# Altium schematic sheet DC309A_CoverPage_Compact.SchDoc: CoverPage
size 558 x 431 mm; DrawnBy: KAVIKANNAN; DocumentNumber: 1; SheetNumber: 1; SheetTotal: 11; PageSetup: Record=PageOptions|CenterHorizontal=True|CenterVertical=True|PrintScale=1.00|XCorrection=1.00|YCorrection=1.00|PrintKind=0|BorderSize=5000000|LeftOffset=0|BottomOffset=0|Orientation=2|PaperLength=1000|PaperWidth=1000|Scale=100|PaperSource=15|PrintQuality=600|MediaType=1|DitherType=10|PaperKind=Letter|PrintScaleMode=1
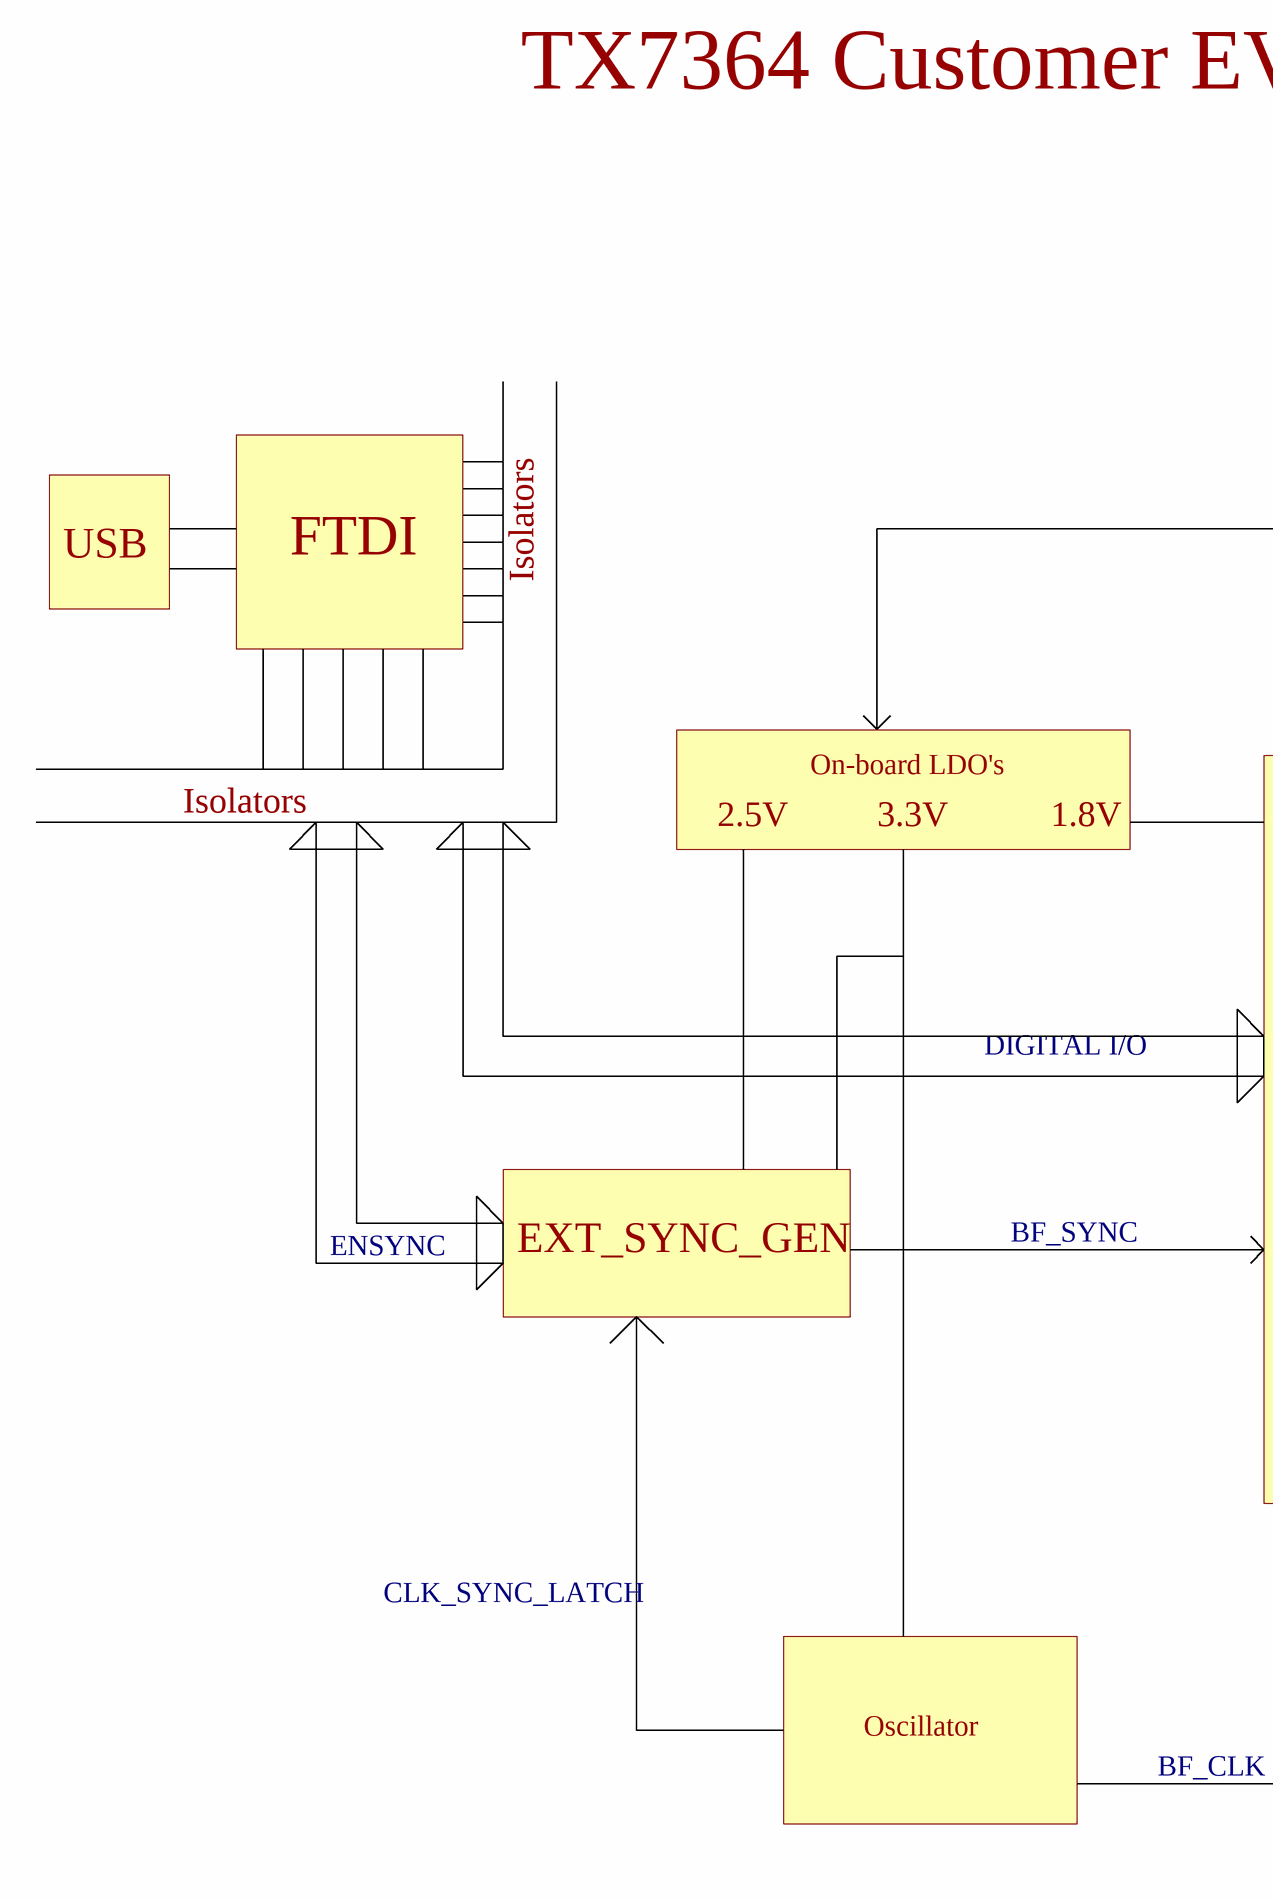
[diagram p0: DC309A_CoverPage_Compact.SchDoc, left]
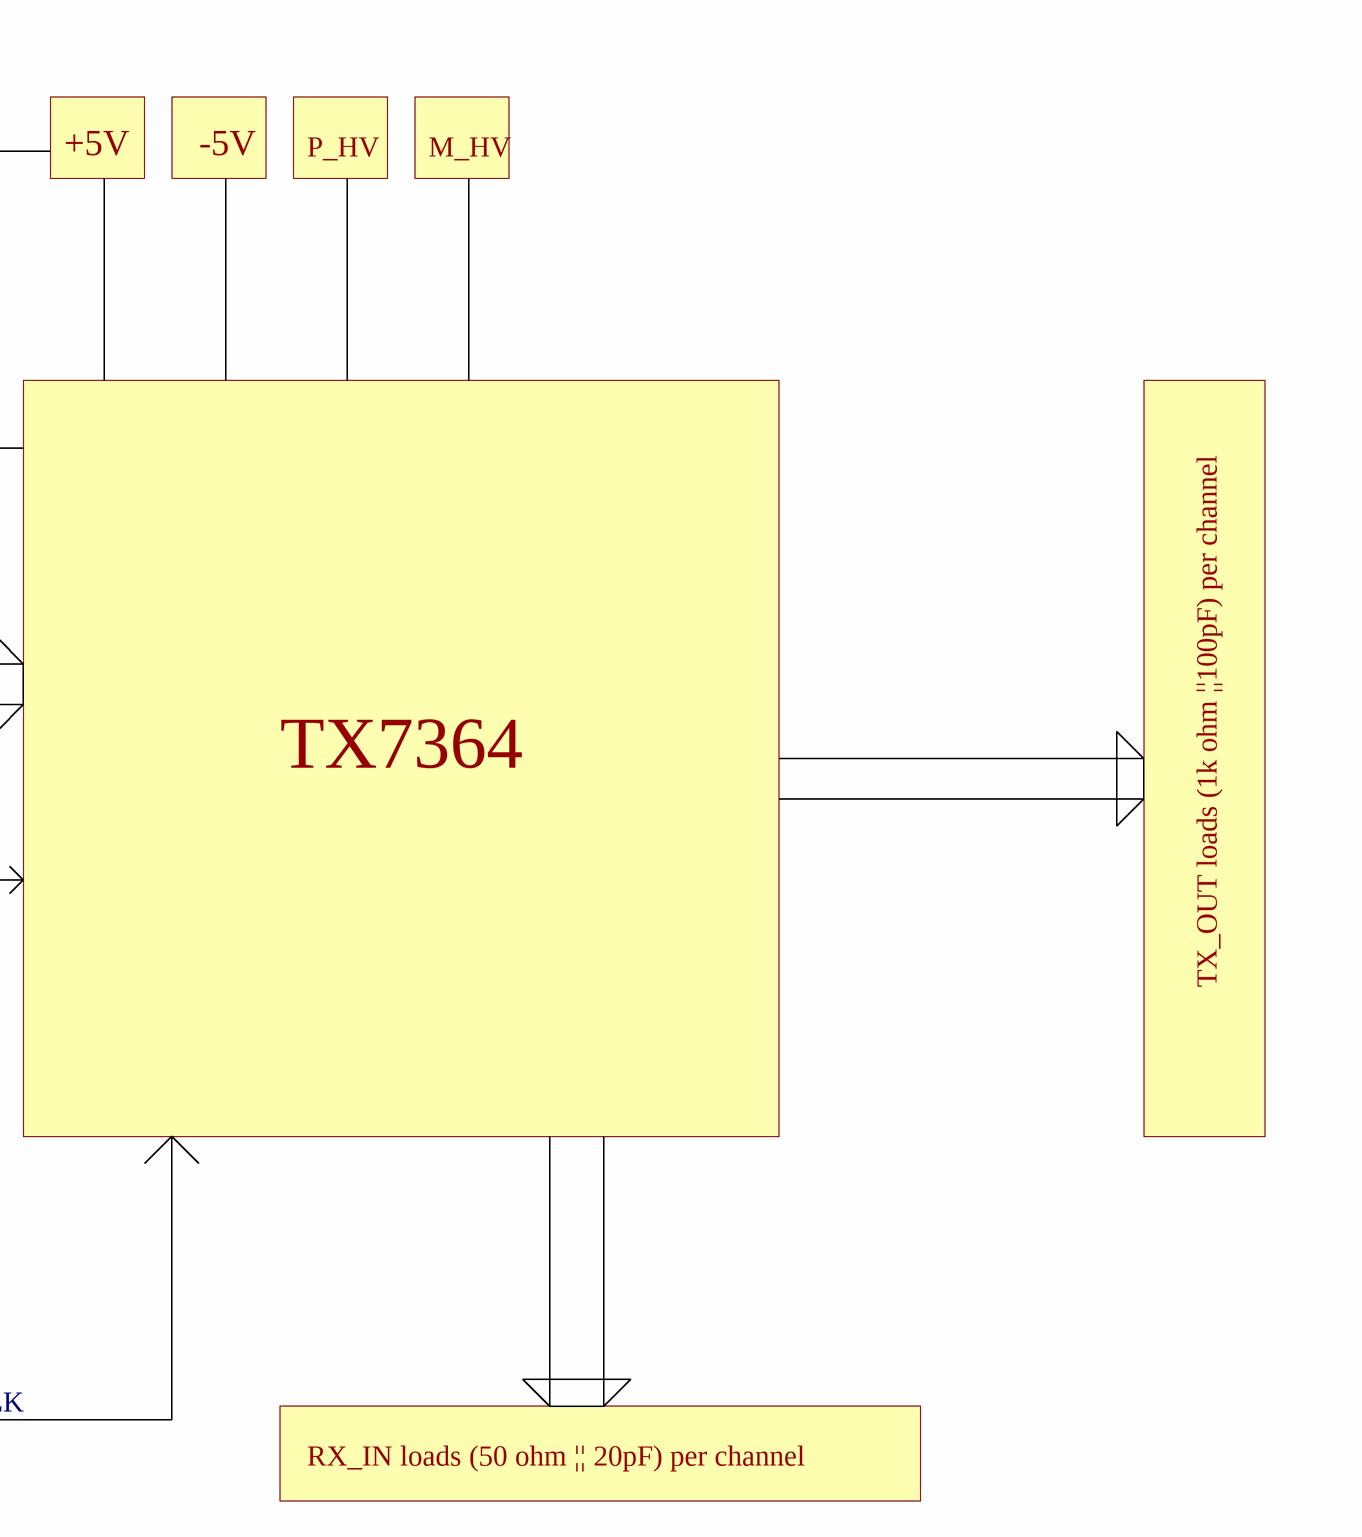
[diagram p1: DC309A_CoverPage_Compact.SchDoc, right]

## Notes on the sheet
- TX7364 Customer EVM : Functional block diagram
- USB
- FTDI
- Isolators
- +5V
- -5V
- P_HV
- M_HV
- On-board LDO's
- 2.5V
- 3.3V
- 1.8V
- DIGITAL I/O
- TX7364
- ENSYNC
- EXT_SYNC_GEN
- BF_SYNC
- TX_OUT loads (1k ohm ||100pF) per channel
- CLK_SYNC_LATCH
- Oscillator
- BF_CLK
- RX_IN loads (50 ohm || 20pF) per channel
- Drawn By:
- SVN Rev:
- Number:
- TID #:
- Orderable:
- Rev:
- Sheet Title:
- File:
- Project Title:
- Designed for:
- Assembly Variant:
- Mod. Date:
- Sheet:
- Size:
- of
- C
- http://www.ti.com
- Texas Instruments and/or its licensors do not warrant the accuracy or completeness of this specification or any information contained therein. Texas Instruments and/or its licensors do not warrant that this design will meet the specifications, will be suitable for your application or fit for any particular purpose, or will operate in an implementation. Texas Instruments and/or its licensors do not warrant that the design is production worthy. You should completely validate and test your design implementation to confirm the system functionality for your application.
- Engineer:
- Contact:
- © Texas Instruments